# EAGLE design Board (EAGLE 7.2.0)
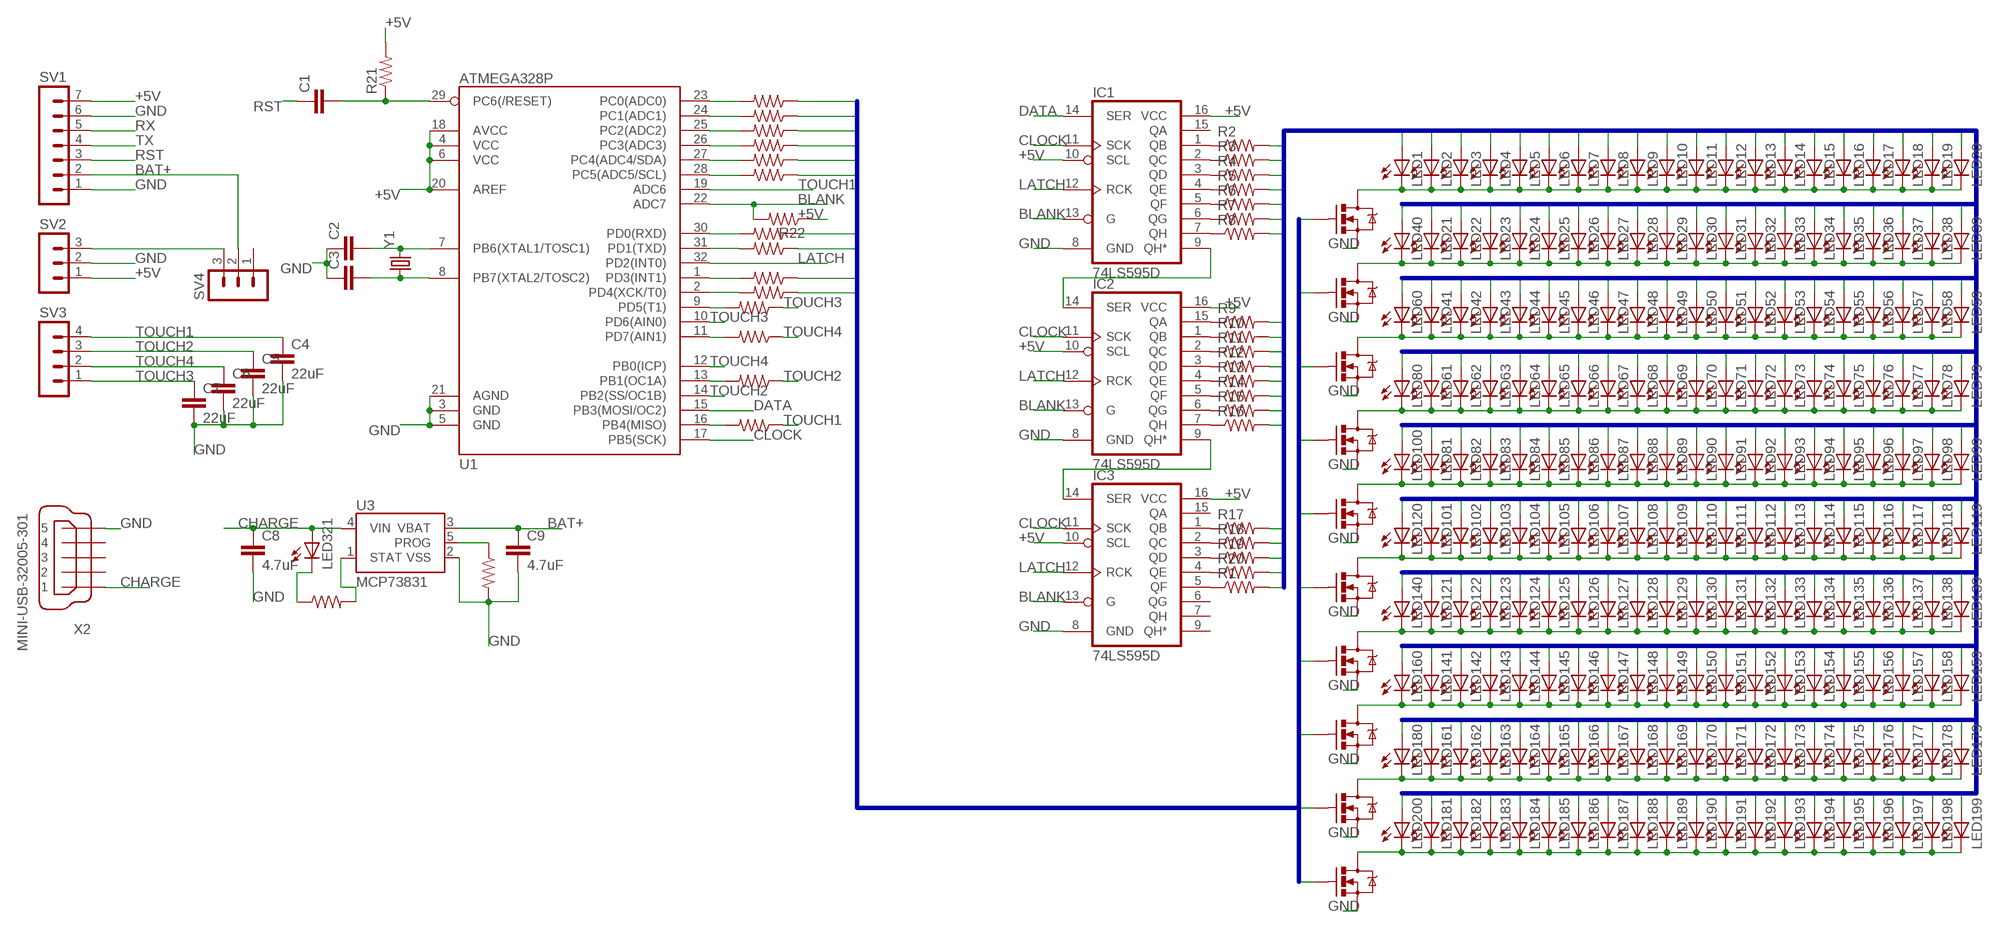
[diagram p0: schematic, sheet 1]

## Parts
2K  2K  100OHM1/10W1%(0603)  [0603-RES]
470R  470R  100OHM1/10W1%(0603)  [0603-RES]
C1  CAPPTH1  [CAP-PTH-5MM]
C2  22uF  22UF-6.3V-20%(0805)  [0805]
C3  22uF  22UF-6.3V-20%(0805)  [0805]
C4  22uF  22UF-6.3V-20%(0805)  [0805]
C5  22uF  22UF-6.3V-20%(0805)  [0805]
C6  22uF  22UF-6.3V-20%(0805)  [0805]
C7  22uF  22UF-6.3V-20%(0805)  [0805]
C8  4.7uF  0.1UF-25V(+80/-20%)(0603)  [0603-CAP]
C9  4.7uF  0.1UF-25V(+80/-20%)(0603)  [0603-CAP]
IC1  74LS595D  [SO16]
IC2  74LS595D  [SO16]
IC3  74LS595D  [SO16]
LED1  LED0603  [LED-0603]
LED2  LED0603  [LED-0603]
LED3  LED0603  [LED-0603]
LED4  LED0603  [LED-0603]
LED5  LED0603  [LED-0603]
LED6  LED0603  [LED-0603]
LED7  LED0603  [LED-0603]
LED8  LED0603  [LED-0603]
LED9  LED0603  [LED-0603]
LED10  LED0603  [LED-0603]
LED11  LED0603  [LED-0603]
LED12  LED0603  [LED-0603]
LED13  LED0603  [LED-0603]
LED14  LED0603  [LED-0603]
LED15  LED0603  [LED-0603]
LED16  LED0603  [LED-0603]
LED17  LED0603  [LED-0603]
LED18  LED0603  [LED-0603]
LED19  LED0603  [LED-0603]
LED20  LED0603  [LED-0603]
LED21  LED0603  [LED-0603]
LED22  LED0603  [LED-0603]
LED23  LED0603  [LED-0603]
LED24  LED0603  [LED-0603]
LED25  LED0603  [LED-0603]
LED26  LED0603  [LED-0603]
LED27  LED0603  [LED-0603]
LED28  LED0603  [LED-0603]
LED29  LED0603  [LED-0603]
LED30  LED0603  [LED-0603]
LED31  LED0603  [LED-0603]
LED32  LED0603  [LED-0603]
LED33  LED0603  [LED-0603]
LED34  LED0603  [LED-0603]
LED35  LED0603  [LED-0603]
LED36  LED0603  [LED-0603]
LED37  LED0603  [LED-0603]
LED38  LED0603  [LED-0603]
LED39  LED0603  [LED-0603]
LED40  LED0603  [LED-0603]
LED41  LED0603  [LED-0603]
LED42  LED0603  [LED-0603]
LED43  LED0603  [LED-0603]
LED44  LED0603  [LED-0603]
LED45  LED0603  [LED-0603]
LED46  LED0603  [LED-0603]
LED47  LED0603  [LED-0603]
LED48  LED0603  [LED-0603]
LED49  LED0603  [LED-0603]
LED50  LED0603  [LED-0603]
LED51  LED0603  [LED-0603]
LED52  LED0603  [LED-0603]
LED53  LED0603  [LED-0603]
LED54  LED0603  [LED-0603]
LED55  LED0603  [LED-0603]
LED56  LED0603  [LED-0603]
LED57  LED0603  [LED-0603]
LED58  LED0603  [LED-0603]
LED59  LED0603  [LED-0603]
LED60  LED0603  [LED-0603]
LED61  LED0603  [LED-0603]
LED62  LED0603  [LED-0603]
LED63  LED0603  [LED-0603]
LED64  LED0603  [LED-0603]
LED65  LED0603  [LED-0603]
LED66  LED0603  [LED-0603]
LED67  LED0603  [LED-0603]
LED68  LED0603  [LED-0603]
LED69  LED0603  [LED-0603]
LED70  LED0603  [LED-0603]
LED71  LED0603  [LED-0603]
LED72  LED0603  [LED-0603]
LED73  LED0603  [LED-0603]
LED74  LED0603  [LED-0603]
LED75  LED0603  [LED-0603]
LED76  LED0603  [LED-0603]
LED77  LED0603  [LED-0603]
LED78  LED0603  [LED-0603]
LED79  LED0603  [LED-0603]
LED80  LED0603  [LED-0603]
LED81  LED0603  [LED-0603]
LED82  LED0603  [LED-0603]
LED83  LED0603  [LED-0603]
LED84  LED0603  [LED-0603]
LED85  LED0603  [LED-0603]
LED86  LED0603  [LED-0603]
LED87  LED0603  [LED-0603]
LED88  LED0603  [LED-0603]
LED89  LED0603  [LED-0603]
LED90  LED0603  [LED-0603]
LED91  LED0603  [LED-0603]
LED92  LED0603  [LED-0603]
LED93  LED0603  [LED-0603]
LED94  LED0603  [LED-0603]
LED95  LED0603  [LED-0603]
LED96  LED0603  [LED-0603]
LED97  LED0603  [LED-0603]
LED98  LED0603  [LED-0603]
LED99  LED0603  [LED-0603]
LED100  LED0603  [LED-0603]
LED101  LED0603  [LED-0603]
LED102  LED0603  [LED-0603]
LED103  LED0603  [LED-0603]
LED104  LED0603  [LED-0603]
LED105  LED0603  [LED-0603]
LED106  LED0603  [LED-0603]
LED107  LED0603  [LED-0603]
LED108  LED0603  [LED-0603]
LED109  LED0603  [LED-0603]
LED110  LED0603  [LED-0603]
LED111  LED0603  [LED-0603]
LED112  LED0603  [LED-0603]
LED113  LED0603  [LED-0603]
LED114  LED0603  [LED-0603]
LED115  LED0603  [LED-0603]
LED116  LED0603  [LED-0603]
LED117  LED0603  [LED-0603]
LED118  LED0603  [LED-0603]
LED119  LED0603  [LED-0603]
LED120  LED0603  [LED-0603]
LED121  LED0603  [LED-0603]
LED122  LED0603  [LED-0603]
LED123  LED0603  [LED-0603]
LED124  LED0603  [LED-0603]
LED125  LED0603  [LED-0603]
LED126  LED0603  [LED-0603]
LED127  LED0603  [LED-0603]
LED128  LED0603  [LED-0603]
LED129  LED0603  [LED-0603]
LED130  LED0603  [LED-0603]
LED131  LED0603  [LED-0603]
LED132  LED0603  [LED-0603]
LED133  LED0603  [LED-0603]
LED134  LED0603  [LED-0603]
LED135  LED0603  [LED-0603]
LED136  LED0603  [LED-0603]
LED137  LED0603  [LED-0603]
LED138  LED0603  [LED-0603]
LED139  LED0603  [LED-0603]
LED140  LED0603  [LED-0603]
LED141  LED0603  [LED-0603]
LED142  LED0603  [LED-0603]
LED143  LED0603  [LED-0603]
LED144  LED0603  [LED-0603]
LED145  LED0603  [LED-0603]
LED146  LED0603  [LED-0603]
LED147  LED0603  [LED-0603]
LED148  LED0603  [LED-0603]
LED149  LED0603  [LED-0603]
LED150  LED0603  [LED-0603]
LED151  LED0603  [LED-0603]
LED152  LED0603  [LED-0603]
LED153  LED0603  [LED-0603]
LED154  LED0603  [LED-0603]
LED155  LED0603  [LED-0603]
LED156  LED0603  [LED-0603]
LED157  LED0603  [LED-0603]
LED158  LED0603  [LED-0603]
LED159  LED0603  [LED-0603]
LED160  LED0603  [LED-0603]
LED161  LED0603  [LED-0603]
LED162  LED0603  [LED-0603]
LED163  LED0603  [LED-0603]
LED164  LED0603  [LED-0603]
LED165  LED0603  [LED-0603]
LED166  LED0603  [LED-0603]
LED167  LED0603  [LED-0603]
LED168  LED0603  [LED-0603]
LED169  LED0603  [LED-0603]
LED170  LED0603  [LED-0603]
LED171  LED0603  [LED-0603]
LED172  LED0603  [LED-0603]
LED173  LED0603  [LED-0603]
LED174  LED0603  [LED-0603]
LED175  LED0603  [LED-0603]
LED176  LED0603  [LED-0603]
LED177  LED0603  [LED-0603]
LED178  LED0603  [LED-0603]
LED179  LED0603  [LED-0603]
LED180  LED0603  [LED-0603]
LED181  LED0603  [LED-0603]
LED182  LED0603  [LED-0603]
LED183  LED0603  [LED-0603]
LED184  LED0603  [LED-0603]
LED185  LED0603  [LED-0603]
LED186  LED0603  [LED-0603]
LED187  LED0603  [LED-0603]
LED188  LED0603  [LED-0603]
LED189  LED0603  [LED-0603]
LED190  LED0603  [LED-0603]
LED191  LED0603  [LED-0603]
LED192  LED0603  [LED-0603]
LED193  LED0603  [LED-0603]
LED194  LED0603  [LED-0603]
LED195  LED0603  [LED-0603]
LED196  LED0603  [LED-0603]
LED197  LED0603  [LED-0603]
LED198  LED0603  [LED-0603]
LED199  LED0603  [LED-0603]
LED200  LED0603  [LED-0603]
LED321  LED0603  [LED-0603]
Q1  MOSFET-NCHANNELBSS123LT1G  [SOT23]
Q2  MOSFET-NCHANNELBSS123LT1G  [SOT23]
Q3  MOSFET-NCHANNELBSS123LT1G  [SOT23]
Q6  MOSFET-NCHANNELBSS123LT1G  [SOT23]
Q8  MOSFET-NCHANNELBSS123LT1G  [SOT23]
Q10  MOSFET-NCHANNELBSS123LT1G  [SOT23]
Q12  MOSFET-NCHANNELBSS123LT1G  [SOT23]
Q14  MOSFET-NCHANNELBSS123LT1G  [SOT23]
Q16  MOSFET-NCHANNELBSS123LT1G  [SOT23]
Q19  MOSFET-NCHANNELBSS123LT1G  [SOT23]
R1  100  100OHM1/10W1%(0603)  [0603-RES]
R2  100  100OHM1/10W1%(0603)  [0603-RES]
R3  100  100OHM1/10W1%(0603)  [0603-RES]
R4  100  100OHM1/10W1%(0603)  [0603-RES]
R5  100  100OHM1/10W1%(0603)  [0603-RES]
R6  100  100OHM1/10W1%(0603)  [0603-RES]
R7  100  100OHM1/10W1%(0603)  [0603-RES]
R8  100  100OHM1/10W1%(0603)  [0603-RES]
R9  100  100OHM1/10W1%(0603)  [0603-RES]
R10  100  100OHM1/10W1%(0603)  [0603-RES]
R11  100  100OHM1/10W1%(0603)  [0603-RES]
R12  100  100OHM1/10W1%(0603)  [0603-RES]
R13  100  100OHM1/10W1%(0603)  [0603-RES]
R14  100  100OHM1/10W1%(0603)  [0603-RES]
R15  100  100OHM1/10W1%(0603)  [0603-RES]
R16  100  100OHM1/10W1%(0603)  [0603-RES]
R17  100  100OHM1/10W1%(0603)  [0603-RES]
R18  100  100OHM1/10W1%(0603)  [0603-RES]
R19  100  100OHM1/10W1%(0603)  [0603-RES]
R20  100  100OHM1/10W1%(0603)  [0603-RES]
R21  10K  100OHM1/10W1%(0603)  [0603-RES]
R22  10K  100OHM1/10W1%(0603)  [0603-RES]
R23  1M  100OHM1/10W1%(0603)  [0603-RES]
R24  1M  100OHM1/10W1%(0603)  [0603-RES]
R26  1M  100OHM1/10W1%(0603)  [0603-RES]
R30  100  100OHM1/10W1%(0603)  [0603-RES]
R31  100  100OHM1/10W1%(0603)  [0603-RES]
R32  100  100OHM1/10W1%(0603)  [0603-RES]
R33  100  100OHM1/10W1%(0603)  [0603-RES]
R34  100  100OHM1/10W1%(0603)  [0603-RES]
R35  100  100OHM1/10W1%(0603)  [0603-RES]
R36  100  100OHM1/10W1%(0603)  [0603-RES]
R37  100  100OHM1/10W1%(0603)  [0603-RES]
R38  100  100OHM1/10W1%(0603)  [0603-RES]
R39  100  100OHM1/10W1%(0603)  [0603-RES]
R40  1M  100OHM1/10W1%(0603)  [0603-RES]
SV1  MA07-1  [MA07-1]
SV2  MA03-1  [MA03-1]
SV3  MA04-1  [MA04-1]
SV4  MA03-1  [MA03-1]
U1  ATMEGA328P  ATMEGA328_SMT  [TQFP32-08]
U3  MCP73831  [SOT23-5]
X2  MINI-USB-32005-301  [32005-301]
Y1  CRYSTAL5X3  [CRYSTAL-SMD-5X3]

## Nets
+5V: IC1.10(SCL) IC1.16(VCC) IC2.10(SCL) IC2.16(VCC) IC3.10(SCL) IC3.16(VCC) R21.2 R22.1 SV1.7 SV2.1 U1.4(VCC) U1.6(VCC) U1.18(AVCC) U1.20(AREF)
A0: Q1.1(G) R37.1
A1: Q2.1(G) R36.1
A2: Q3.1(G) R39.1
A3: Q6.1(G) R38.1
A4: Q8.1(G) R35.1
A5: Q10.1(G) R34.1
A6: Q12.1(G) R33.1
A7: Q14.1(G) R32.1
A8: Q16.1(G) R31.1
A9: Q19.1(G) R30.1
BAT+: C9.1 SV1.2 SV4.2 U3.3(VBAT)
BLANK: IC1.13(G) IC2.13(G) IC3.13(G) R22.2 U1.22(ADC7)
CHARGE: C8.1 LED321.A U3.4(VIN) X2.1
CLOCK: IC1.11(SCK) IC2.11(SCK) IC3.11(SCK) U1.17(PB5(SCK))
D0: LED20.A LED40.A LED60.A LED80.A LED100.A LED120.A LED140.A LED160.A LED180.A LED200.A R1.2
D1: LED2.A LED21.A LED41.A LED61.A LED81.A LED101.A LED121.A LED141.A LED161.A LED181.A R2.2
D2: LED3.A LED22.A LED42.A LED62.A LED82.A LED102.A LED122.A LED142.A LED162.A LED182.A R3.2
D3: LED4.A LED23.A LED43.A LED63.A LED83.A LED103.A LED123.A LED143.A LED163.A LED183.A R4.2
D4: LED5.A LED24.A LED44.A LED64.A LED84.A LED104.A LED124.A LED144.A LED164.A LED184.A R5.2
D5: LED6.A LED25.A LED45.A LED65.A LED85.A LED105.A LED125.A LED145.A LED165.A LED185.A R6.2
D6: LED7.A LED26.A LED46.A LED66.A LED86.A LED106.A LED126.A LED146.A LED166.A LED186.A R7.2
D7: LED8.A LED27.A LED47.A LED67.A LED87.A LED107.A LED127.A LED147.A LED167.A LED187.A R8.2
D8: LED9.A LED28.A LED48.A LED68.A LED88.A LED108.A LED128.A LED148.A LED168.A LED188.A R9.2
D9: LED10.A LED29.A LED49.A LED69.A LED89.A LED109.A LED129.A LED149.A LED169.A LED189.A R10.2
D10: LED11.A LED30.A LED50.A LED70.A LED90.A LED110.A LED130.A LED150.A LED170.A LED190.A R11.2
D11: LED12.A LED31.A LED51.A LED71.A LED91.A LED111.A LED131.A LED151.A LED171.A LED191.A R12.2
D12: LED13.A LED32.A LED52.A LED72.A LED92.A LED112.A LED132.A LED152.A LED172.A LED192.A R13.2
D13: LED14.A LED33.A LED53.A LED73.A LED93.A LED113.A LED133.A LED153.A LED173.A LED193.A R14.2
D14: LED15.A LED34.A LED54.A LED74.A LED94.A LED114.A LED134.A LED154.A LED174.A LED194.A R15.2
D15: LED16.A LED35.A LED55.A LED75.A LED95.A LED115.A LED135.A LED155.A LED175.A LED195.A R16.2
D16: LED17.A LED36.A LED56.A LED76.A LED96.A LED116.A LED136.A LED156.A LED176.A LED196.A R17.2
D17: LED18.A LED37.A LED57.A LED77.A LED97.A LED117.A LED137.A LED157.A LED177.A LED197.A R18.2
D18: LED19.A LED38.A LED58.A LED78.A LED98.A LED118.A LED138.A LED158.A LED178.A LED198.A R19.2
D19: LED1.A LED39.A LED59.A LED79.A LED99.A LED119.A LED139.A LED159.A LED179.A LED199.A R20.2
DATA: IC1.14(SER) U1.15(PB3(MOSI/OC2))
GND: 2K.2 C2.1 C3.1 C4.2 C5.2 C6.2 C7.2 C8.2 C9.2 IC1.8(GND) IC2.8(GND) IC3.8(GND) Q1.2(S) Q2.2(S) Q3.2(S) Q6.2(S) Q8.2(S) Q10.2(S) Q12.2(S) Q14.2(S) Q16.2(S) Q19.2(S) SV1.1 SV1.6 SV2.2 U1.3(GND) U1.5(GND) U1.21(AGND) U3.2(VSS) X2.5
LATCH: IC1.12(RCK) IC2.12(RCK) IC3.12(RCK) U1.32(PD2(INT0))
N$1: LED1.C LED2.C LED3.C LED4.C LED5.C LED6.C LED7.C LED8.C LED9.C LED10.C LED11.C LED12.C LED13.C LED14.C LED15.C LED16.C LED17.C LED18.C LED19.C LED20.C Q1.3(D)
N$2: LED21.C LED22.C LED23.C LED24.C LED25.C LED26.C LED27.C LED28.C LED29.C LED30.C LED31.C LED32.C LED33.C LED34.C LED35.C LED36.C LED37.C LED38.C LED39.C LED40.C Q2.3(D)
N$3: LED181.C LED182.C LED183.C LED184.C LED185.C LED186.C LED187.C LED188.C LED189.C LED190.C LED191.C LED192.C LED193.C LED194.C LED195.C LED196.C LED197.C LED198.C LED199.C LED200.C Q19.3(D)
N$4: LED41.C LED42.C LED43.C LED44.C LED45.C LED46.C LED47.C LED48.C LED49.C LED50.C LED51.C LED52.C LED53.C LED54.C LED55.C LED56.C LED57.C LED58.C LED59.C LED60.C Q3.3(D)
N$5: LED61.C LED62.C LED63.C LED64.C LED65.C LED66.C LED67.C LED68.C LED69.C LED70.C LED71.C LED72.C LED73.C LED74.C LED75.C LED76.C LED77.C LED78.C LED79.C LED80.C Q6.3(D)
N$6: LED81.C LED82.C LED83.C LED84.C LED85.C LED86.C LED87.C LED88.C LED89.C LED90.C LED91.C LED92.C LED93.C LED94.C LED95.C LED96.C LED97.C LED98.C LED99.C LED100.C Q8.3(D)
N$7: LED101.C LED102.C LED103.C LED104.C LED105.C LED106.C LED107.C LED108.C LED109.C LED110.C LED111.C LED112.C LED113.C LED114.C LED115.C LED116.C LED117.C LED118.C LED119.C LED120.C Q10.3(D)
N$8: LED121.C LED122.C LED123.C LED124.C LED125.C LED126.C LED127.C LED128.C LED129.C LED130.C LED131.C LED132.C LED133.C LED134.C LED135.C LED136.C LED137.C LED138.C LED139.C LED140.C Q12.3(D)
N$9: LED141.C LED142.C LED143.C LED144.C LED145.C LED146.C LED147.C LED148.C LED149.C LED150.C LED151.C LED152.C LED153.C LED154.C LED155.C LED156.C LED157.C LED158.C LED159.C LED160.C Q14.3(D)
N$10: LED161.C LED162.C LED163.C LED164.C LED165.C LED166.C LED167.C LED168.C LED169.C LED170.C LED171.C LED172.C LED173.C LED174.C LED175.C LED176.C LED177.C LED178.C LED179.C LED180.C Q16.3(D)
N$11: R30.2 U1.23(PC0(ADC0))
N$12: R31.2 U1.24(PC1(ADC1))
N$13: R32.2 U1.25(PC2(ADC2))
N$14: R33.2 U1.26(PC3(ADC3))
N$15: R34.2 U1.27(PC4(ADC4/SDA))
N$16: R35.2 U1.28(PC5(ADC5/SCL))
N$17: IC1.2(QC) R3.1
N$18: IC1.3(QD) R4.1
N$19: IC1.4(QE) R5.1
N$20: IC1.5(QF) R6.1
N$21: IC1.6(QG) R7.1
N$22: IC1.7(QH) R8.1
N$23: IC2.15(QA) R9.1
N$24: IC2.1(QB) R10.1
N$25: IC2.2(QC) R11.1
N$26: IC2.3(QD) R12.1
N$27: IC2.4(QE) R13.1
N$28: IC2.5(QF) R14.1
N$29: IC2.6(QG) R15.1
N$30: IC2.7(QH) R16.1
N$31: IC3.1(QB) R17.1
N$32: IC3.2(QC) R18.1
N$33: IC3.3(QD) R19.1
N$34: IC3.4(QE) R20.1
N$35: IC3.5(QF) R1.1
N$36: IC1.1(QB) R2.1
N$37: C2.2 U1.7(PB6(XTAL1/TOSC1)) Y1.3
N$38: C1.2 R21.1 U1.29(PC6(/RESET))
N$39: C3.2 U1.8(PB7(XTAL2/TOSC2)) Y1.1
N$40: SV2.3 SV4.3
N$41: 470R.1 LED321.C
N$42: 470R.2 U3.1(STAT)
N$44: R23.2 U1.9(PD5(T1))
N$45: R24.2 U1.13(PB1(OC1A))
N$46: 2K.1 U3.5(PROG)
N$47: IC1.9(QH*) IC2.14(SER)
N$48: IC2.9(QH*) IC3.14(SER)
N$49: R26.2 U1.16(PB4(MISO))
N$52: R40.2 U1.11(PD7(AIN1))
N$54: R36.2 U1.1(PD3(INT1))
N$55: R37.2 U1.2(PD4(XCK/T0))
RST: C1.1 SV1.3
RX: R38.2 SV1.5 U1.30(PD0(RXD))
TOUCH1: C4.1 R26.1 SV3.4 U1.19(ADC6)
TOUCH2: C5.1 R24.1 SV3.3 U1.14(PB2(SS/OC1B))
TOUCH3: C7.1 R23.1 SV3.1 U1.10(PD6(AIN0))
TOUCH4: C6.1 R40.1 SV3.2 U1.12(PB0(ICP))
TX: R39.2 SV1.4 U1.31(PD1(TXD))
Unconnected: IC1.15(QA) IC3.6(QG) IC3.7(QH) IC3.9(QH*) IC3.15(QA) SV4.1 X2.2 X2.3 X2.4

## Buses
D[0..19]
A[0..9]

## Library data of the parts
2K 470R R21-R24 R26 R40 = SparkFun-Resistors:100OHM1/10W1%(0603): RES-07863; PROD_ID: RES-07863; VALUE: 100
C1 = SparkFun-Capacitors:CAP: Capacitor Standard 0603 ceramic capacitor, and 0.1" leaded capacitor.
C2-C7 = SparkFun-Capacitors:22UF-6.3V-20%(0805): Ceramic CAP-08402; PROD_ID: CAP-08402
C8 C9 = SparkFun-Capacitors:0.1UF-25V(+80/-20%)(0603): CAP-00810 Ceramic Standard decoupling cap; PROD_ID: CAP-00810; VALUE: 0.1uF
IC1-IC3 = SparkFun-DigitalIC:74*595: 8-bit SHIFT REGISTER, output latch
LED1-LED200 LED321 = SparkFun-LED:LED: LEDs Standard schematic elements and footprints for 5mm, 3mm, 1206, and 0603 sized LEDs. 5mm - Spark Fun Electronics SKU : COM-00529 (and others)
Q1-Q3 Q6 Q8 Q10 Q12 Q14 Q16 Q19 = SparkFun-DiscreteSemi:MOSFET-NCHANNEL: Common NMOSFET Parts MFG P/N Store ID Prod ID FDD8780 TRANS-09984 SI7820DN TRANS-11055 FDS6630A IC-08089 2N7002PW TRANS-11151 FQP30N06L COM-10213 TRANS-10060 BSS123LT1G TRANS-08345 BSS138 TRANS-00830 BS170 2N7000; PROD_ID: TRANS-08345
R1-R20 R30-R39 = SparkFun-Resistors:100OHM1/10W1%(0603): RES-07863; PROD_ID: RES-07863
SV1 = con-lstb:MA07-1: PIN HEADER; OC_FARNELL: unknown; OC_NEWARK: unknown
SV2 SV4 = con-lstb:MA03-1: PIN HEADER; OC_FARNELL: unknown; OC_NEWARK: unknown
SV3 = con-lstb:MA04-1: PIN HEADER; OC_FARNELL: unknown; OC_NEWARK: unknown
U1 = SparkFun-DigitalIC:ATMEGA328_SMT: 32-Pin Atmega328 part Commonly used on Arduino compatible boards Available in QFP and QFN packages TQFP is IC-09069 QFN is non-stock; PROD_ID: IC-09069
U3 = SparkFun-PowerIC:MCP73831: Miniature single cell, fully integrated Li-Ion, Li-polymer charge management controller http://ww1.microchip.com/downloads/en/DeviceDoc/21984a.pdf IC-09995; PROD_ID: IC-09995
X2 = con-cypressindustries:MINI-USB-: MINI USB-B Conector Source: www.cypressindustries.com; OC_FARNELL: unknown; OC_NEWARK: unknown
Y1 = SparkFun-FreqCtrl:CRYSTAL: Various standard crystals. Proven footprints. Spark Fun Electronics SKU : COM-00534

## Board
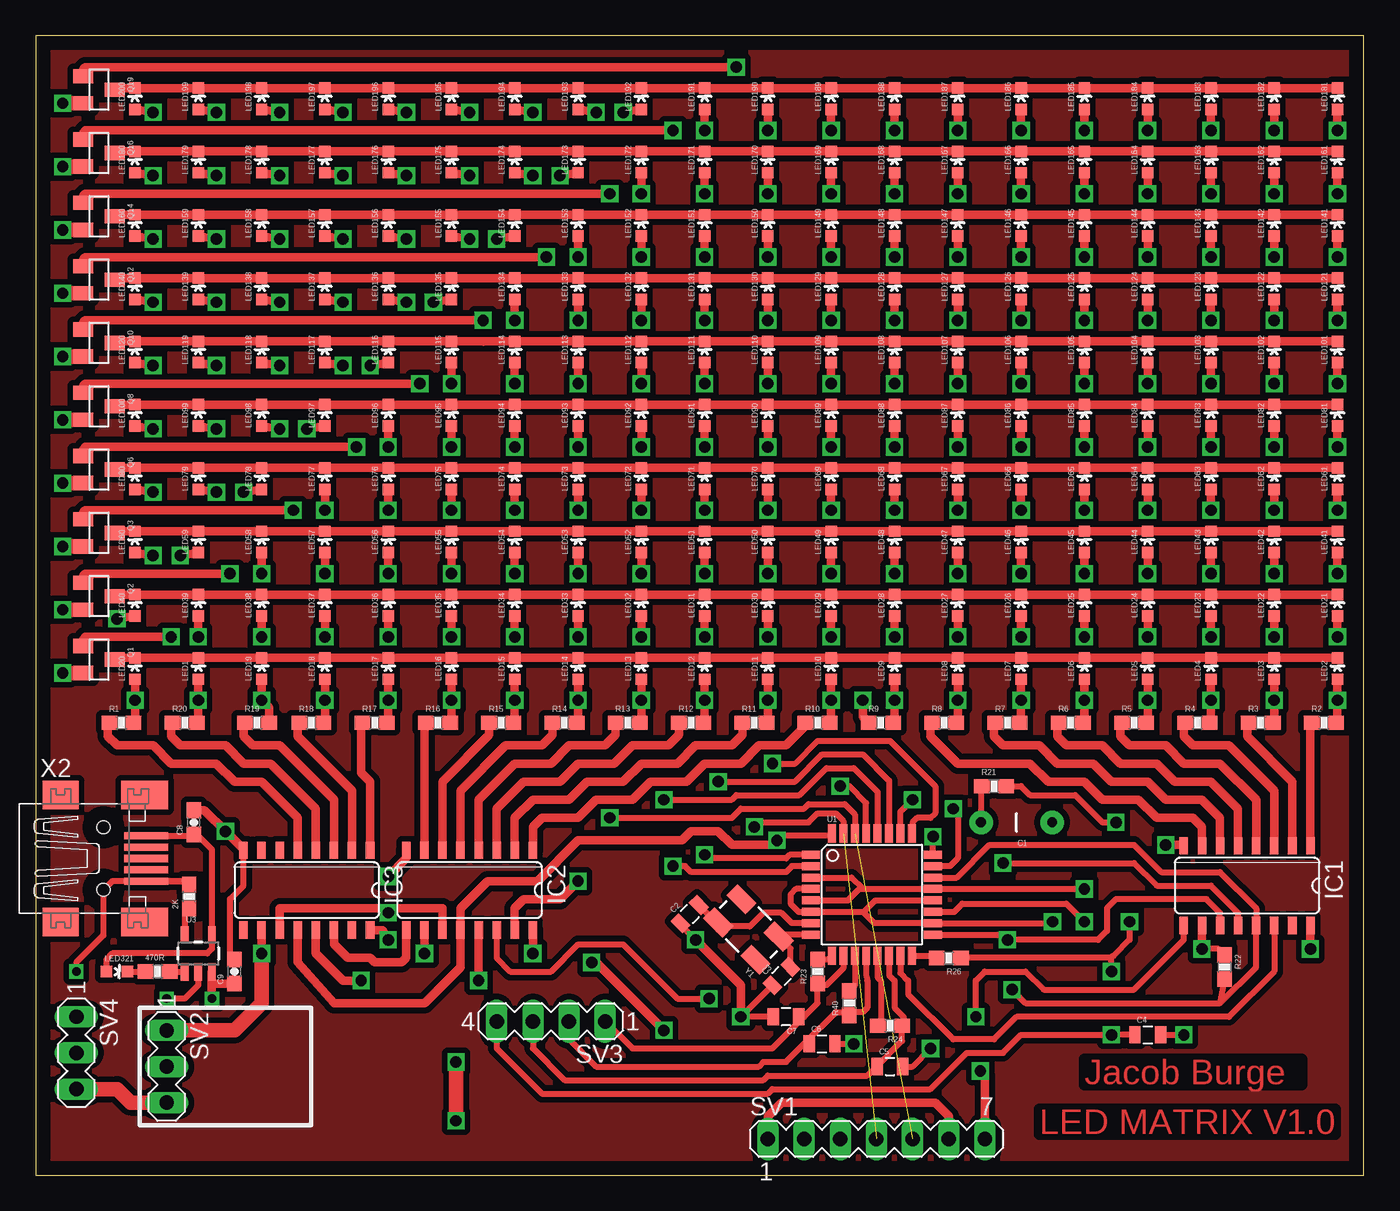
[diagram p1: board, top side]
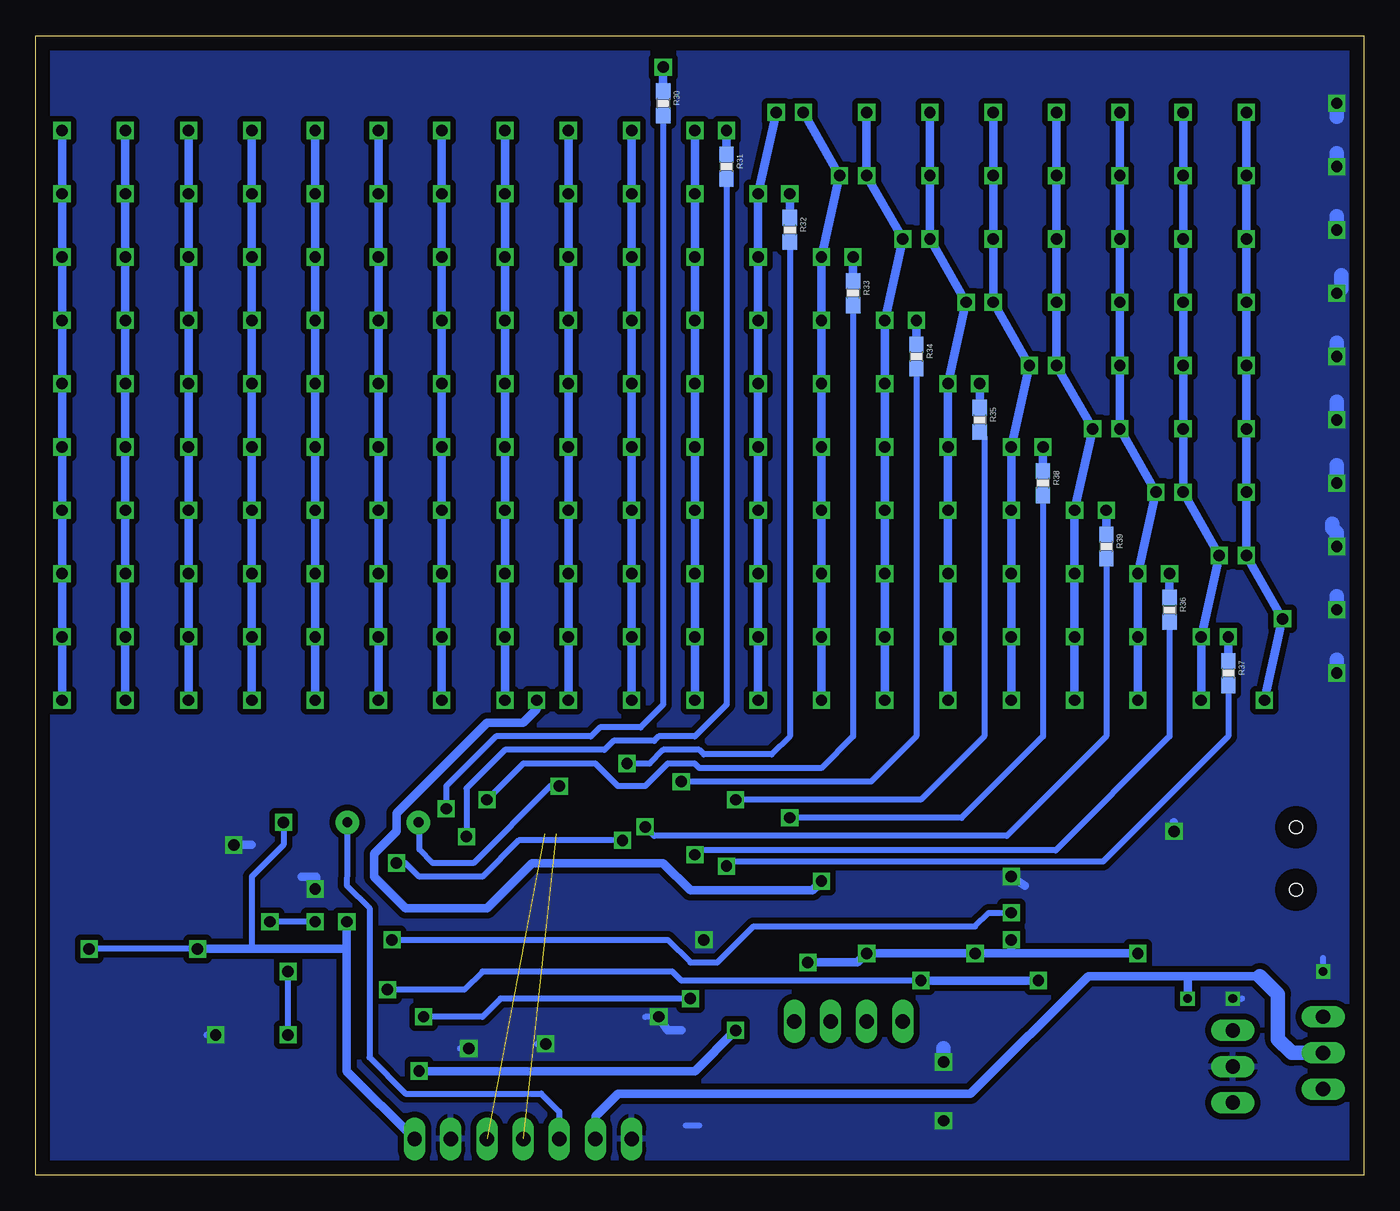
[diagram p2: board, bottom side, seen from below]

Size 93.3 x 80 mm. Coordinates in mm from the lower left corner, seen from the top.
Outline: 0,0 93.3,0 93.3,80 0,80 0,0
Copper layers (1*16): Top 0.035mm / dielectric 1.5mm / Bottom 0.035mm
Design rules "default": minimum track width 10mil, minimum drill 24mil, track to track 8mil, track to pad 8mil, pad to pad 8mil, via to via 8mil, smd to smd 8mil, copper to edge 40mil, drill to drill 8mil, minimum pad ring 10mil, minimum via ring 8mil, stop-mask expansion 4mil, vias tented up to drill 0mil, thermal gap 10mil

### Footprints (pad centres in the part's own frame; a part is rotated, then mirrored left to right if it is on the bottom)
0603-RES = smd 1.1 x 1: 1 -0.85,0; 2 0.85,0
CAP-PTH-5MM = drill 0.7 pad 1.651: 1 -2.5,0; 2 2.5,0
0805 = smd 0.8 x 1.2: 1 -0.9,0; 2 0.9,0
0603-CAP = smd 1.1 x 1: 1 -0.85,0; 2 0.85,0
SO16 = smd 0.6 x 1.2: 1 -4.445,-2.8; 2 -3.175,-2.8; 3 -1.905,-2.8; 4 -0.635,-2.8; 5 0.635,-2.8; 6 1.905,-2.8; 7 3.175,-2.8; 8 4.445,-2.8; 9 4.445,2.8; 10 3.175,2.8; 11 1.905,2.8; 12 0.635,2.8; 13 -0.635,2.8; 14 -1.905,2.8; 15 -3.175,2.8; 16 -4.445,2.8
LED-0603 = smd 0.8 x 0.8: A 0,-0.75; C 0,0.75
SOT23 = smd 1 x 1.4: 1 -0.95,-1.1; 2 0.95,-1.1; 3 0,1.1
MA07-1 = drill 1.016 long: 1 -7.62,0; 2 -5.08,0; 3 -2.54,0; 4 0,0; 5 2.54,0; 6 5.08,0; 7 7.62,0
MA03-1 = drill 1.016 long: 1 -2.54,0; 2 0,0; 3 2.54,0
MA04-1 = drill 1.016 long: 1 -3.81,0; 2 -1.27,0; 3 1.27,0; 4 3.81,0
TQFP32-08 = smd 1.27 x 0.559: 1 -4.293,2.8; 2 -4.293,2; 3 -4.293,1.2; 4 -4.293,0.4; 5 -4.293,-0.4; 6 -4.293,-1.2; 7 -4.293,-2; 8 -4.293,-2.8; 17 4.293,-2.8; 18 4.293,-2; 19 4.293,-1.2; 20 4.293,-0.4; 21 4.293,0.4; 22 4.293,1.2; 23 4.293,2; 24 4.293,2.8 | smd 0.559 x 1.27: 9 -2.8,-4.293; 10 -2,-4.293; 11 -1.2,-4.293; 12 -0.4,-4.293; 13 0.4,-4.293; 14 1.2,-4.293; 15 2,-4.293; 16 2.8,-4.293; 25 2.8,4.293; 26 2,4.293; 27 1.2,4.293; 28 0.4,4.293; 29 -0.4,4.293; 30 -1.2,4.293; 31 -2,4.293; 32 -2.8,4.293
SOT23-5 = smd 0.55 x 1.2: 1 -0.95,-1.3; 2 0,-1.3; 3 0.95,-1.3; 4 0.95,1.3; 5 -0.95,1.3
32005-301 = smd 3.1 x 0.5: 1 3,1.6; 2 3,0.8; 3 3,0; 4 3,-0.8; 5 3,-1.6 | smd 2.5 x 2: M1 -3,-4.45; M2 -3,4.45 | smd 3.3 x 2: M3 2.9,4.45; M4 2.9,-4.45 | hole 0.9: 0,2.2; 0,-2.2
CRYSTAL-SMD-5X3 = smd 1.9 x 1.1: 1 -1.85,-1.15; 2 1.85,-1.15; 3 1.85,1.15; 4 -1.85,1.15

### Placement (x,y rotation side)
2K  10.79,19.55 90 top
470R  8.57,14.29 0 top
C1  68.9,24.77 180 top
C2  45.94,18.32 45 top
C3  52.39,13.97 45 top
C4  78.11,9.84 0 top
C5  60.01,7.62 0 top
C6  55.24,9.21 0 top
C7  52.7,11.11 180 top
C8  11.11,24.77 90 top
C9  13.97,14.29 90 top
IC1  85.09,20.32 180 top
IC2  30.48,20 180 top
IC3  19.05,20 180 top
LED1  11.43,35.56 0 top
LED2  91.44,35.56 0 top
LED3  87,35.56 0 top
LED4  82.55,35.56 0 top
LED5  78.11,35.56 0 top
LED6  73.66,35.56 0 top
LED7  69.22,35.56 0 top
LED8  64.77,35.56 0 top
LED9  60.33,35.56 0 top
LED10  55.88,35.56 0 top
LED11  51.44,35.56 0 top
LED12  46.99,35.56 0 top
LED13  42.55,35.56 0 top
LED14  38.1,35.56 0 top
LED15  33.66,35.56 0 top
LED16  29.21,35.56 0 top
LED17  24.77,35.56 0 top
LED18  20.32,35.56 0 top
LED19  15.88,35.56 0 top
LED20  6.99,35.56 0 top
LED21  91.44,40.01 0 top
LED22  87,40.01 0 top
LED23  82.55,40.01 0 top
LED24  78.11,40.01 0 top
LED25  73.66,40.01 0 top
LED26  69.22,40.01 0 top
LED27  64.77,40.01 0 top
LED28  60.33,40.01 0 top
LED29  55.88,40.01 0 top
LED30  51.44,40.01 0 top
LED31  46.99,40.01 0 top
LED32  42.55,40.01 0 top
LED33  38.1,40.01 0 top
LED34  33.66,40.01 0 top
LED35  29.21,40.01 0 top
LED36  24.77,40.01 0 top
LED37  20.32,40.01 0 top
LED38  15.88,40.01 0 top
LED39  11.43,40.01 0 top
LED40  6.99,40.01 0 top
LED41  91.44,44.45 0 top
LED42  87,44.45 0 top
LED43  82.55,44.45 0 top
LED44  78.11,44.45 0 top
LED45  73.66,44.45 0 top
LED46  69.22,44.45 0 top
LED47  64.77,44.45 0 top
LED48  60.33,44.45 0 top
LED49  55.88,44.45 0 top
LED50  51.44,44.45 0 top
LED51  46.99,44.45 0 top
LED52  42.55,44.45 0 top
LED53  38.1,44.45 0 top
LED54  33.66,44.45 0 top
LED55  29.21,44.45 0 top
LED56  24.77,44.45 0 top
LED57  20.32,44.45 0 top
LED58  15.88,44.45 0 top
LED59  11.43,44.45 0 top
LED60  6.99,44.45 0 top
LED61  91.44,48.9 0 top
LED62  87,48.9 0 top
LED63  82.55,48.9 0 top
LED64  78.11,48.9 0 top
LED65  73.66,48.9 0 top
LED66  69.22,48.9 0 top
LED67  64.77,48.9 0 top
LED68  60.33,48.9 0 top
LED69  55.88,48.9 0 top
LED70  51.44,48.9 0 top
LED71  46.99,48.9 0 top
LED72  42.55,48.9 0 top
LED73  38.1,48.9 0 top
LED74  33.66,48.9 0 top
LED75  29.21,48.9 0 top
LED76  24.77,48.9 0 top
LED77  20.32,48.9 0 top
LED78  15.88,48.9 0 top
LED79  11.43,48.9 0 top
LED80  6.99,48.9 0 top
LED81  91.44,53.34 0 top
LED82  87,53.34 0 top
LED83  82.55,53.34 0 top
LED84  78.11,53.34 0 top
LED85  73.66,53.34 0 top
LED86  69.22,53.34 0 top
LED87  64.77,53.34 0 top
LED88  60.33,53.34 0 top
LED89  55.88,53.34 0 top
LED90  51.44,53.34 0 top
LED91  46.99,53.34 0 top
LED92  42.55,53.34 0 top
LED93  38.1,53.34 0 top
LED94  33.66,53.34 0 top
LED95  29.21,53.34 0 top
LED96  24.77,53.34 0 top
LED97  20.32,53.34 0 top
LED98  15.88,53.34 0 top
LED99  11.43,53.34 0 top
LED100  6.99,53.34 0 top
LED101  91.44,57.78 0 top
LED102  87,57.78 0 top
LED103  82.55,57.78 0 top
LED104  78.11,57.78 0 top
LED105  73.66,57.78 0 top
LED106  69.22,57.78 0 top
LED107  64.77,57.78 0 top
LED108  60.33,57.78 0 top
LED109  55.88,57.78 0 top
LED110  51.44,57.78 0 top
LED111  46.99,57.78 0 top
LED112  42.55,57.78 0 top
LED113  38.1,57.78 0 top
LED114  33.66,57.78 0 top
LED115  29.21,57.78 0 top
LED116  24.77,57.78 0 top
LED117  20.32,57.78 0 top
LED118  15.88,57.78 0 top
LED119  11.43,57.78 0 top
LED120  6.99,57.78 0 top
LED121  91.44,62.23 0 top
LED122  87,62.23 0 top
LED123  82.55,62.23 0 top
LED124  78.11,62.23 0 top
LED125  73.66,62.23 0 top
LED126  69.22,62.23 0 top
LED127  64.77,62.23 0 top
LED128  60.33,62.23 0 top
LED129  55.88,62.23 0 top
LED130  51.44,62.23 0 top
LED131  46.99,62.23 0 top
LED132  42.55,62.23 0 top
LED133  38.1,62.23 0 top
LED134  33.66,62.23 0 top
LED135  29.21,62.23 0 top
LED136  24.77,62.23 0 top
LED137  20.32,62.23 0 top
LED138  15.88,62.23 0 top
LED139  11.43,62.23 0 top
LED140  6.99,62.23 0 top
LED141  91.44,66.67 0 top
LED142  87,66.67 0 top
LED143  82.55,66.67 0 top
LED144  78.11,66.67 0 top
LED145  73.66,66.67 0 top
LED146  69.22,66.67 0 top
LED147  64.77,66.67 0 top
LED148  60.33,66.67 0 top
LED149  55.88,66.67 0 top
LED150  51.44,66.67 0 top
LED151  46.99,66.67 0 top
LED152  42.55,66.67 0 top
LED153  38.1,66.67 0 top
LED154  33.66,66.67 0 top
LED155  29.21,66.67 0 top
LED156  24.77,66.67 0 top
LED157  20.32,66.67 0 top
LED158  15.88,66.67 0 top
LED159  11.43,66.67 0 top
LED160  6.99,66.67 0 top
LED161  91.44,71.12 0 top
LED162  87,71.12 0 top
LED163  82.55,71.12 0 top
LED164  78.11,71.12 0 top
LED165  73.66,71.12 0 top
LED166  69.22,71.12 0 top
LED167  64.77,71.12 0 top
LED168  60.33,71.12 0 top
LED169  55.88,71.12 0 top
LED170  51.44,71.12 0 top
LED171  46.99,71.12 0 top
LED172  42.55,71.12 0 top
LED173  38.1,71.12 0 top
LED174  33.66,71.12 0 top
LED175  29.21,71.12 0 top
LED176  24.77,71.12 0 top
LED177  20.32,71.12 0 top
LED178  15.88,71.12 0 top
LED179  11.43,71.12 0 top
LED180  6.99,71.12 0 top
LED181  91.44,75.56 0 top
LED182  87,75.56 0 top
LED183  82.55,75.56 0 top
LED184  78.11,75.56 0 top
LED185  73.66,75.56 0 top
LED186  69.22,75.56 0 top
LED187  64.77,75.56 0 top
LED188  60.33,75.56 0 top
LED189  55.88,75.56 0 top
LED190  51.44,75.56 0 top
LED191  46.99,75.56 0 top
LED192  42.55,75.56 0 top
LED193  38.1,75.56 0 top
LED194  33.66,75.56 0 top
LED195  29.21,75.56 0 top
LED196  24.77,75.56 0 top
LED197  20.32,75.56 0 top
LED198  15.88,75.56 0 top
LED199  11.43,75.56 0 top
LED200  6.99,75.56 0 top
LED321  5.71,14.29 270 top
Q1  4.45,36.2 270 top
Q2  4.45,40.64 270 top
Q3  4.45,45.09 270 top
Q6  4.45,49.53 270 top
Q8  4.45,53.98 270 top
Q10  4.45,58.42 270 top
Q12  4.45,62.87 270 top
Q14  4.45,67.31 270 top
Q16  4.45,71.75 270 top
Q19  4.45,76.2 270 top
R1  6.03,31.75 0 top
R2  90.49,31.75 0 top
R3  86.04,31.75 0 top
R4  81.6,31.75 0 top
R5  77.15,31.75 0 top
R6  72.71,31.75 0 top
R7  68.26,31.75 0 top
R8  63.82,31.75 0 top
R9  59.37,31.75 0 top
R10  54.93,31.75 0 top
R11  50.48,31.75 0 top
R12  46.04,31.75 0 top
R13  41.59,31.75 0 top
R14  37.15,31.75 0 top
R15  32.7,31.75 0 top
R16  28.26,31.75 0 top
R17  23.81,31.75 0 top
R18  19.37,31.75 0 top
R19  15.56,31.75 0 top
R20  10.48,31.75 0 top
R21  67.31,27.3 0 top
R22  83.5,14.61 270 top
R23  54.93,14.29 90 top
R24  60.01,10.48 180 top
R26  64.14,15.24 180 top
R30  49.21,75.25 270 bottom
R31  44.77,70.8 270 bottom
R32  40.32,66.36 270 bottom
R33  35.88,61.91 270 bottom
R34  31.43,57.47 270 bottom
R35  26.99,53.02 270 bottom
R36  13.65,39.69 270 bottom
R37  9.53,35.24 270 bottom
R38  22.54,48.58 270 bottom
R39  18.1,44.13 270 bottom
R40  57.15,12.06 90 top
SV1  59.05,2.54 0 top
SV2  9.21,7.62 270 top
SV3  36.2,10.79 180 top
SV4  2.86,8.57 270 top
U1  58.74,19.68 0 top
U3  11.43,15.56 0 top
X2  4.76,22.23 0 top
Y1  50.07,17.24 135 top

### Tracks (layer width: path | path; a pad name or v marks a point on that pad's centre or on a via)
+5V  (via drill 0.8)
  Top 0.406: 58.1,18.48 U1.6 53.59,18.48 53.02,19.05 53.02,19.68 53.42,20.09 U1.4 | 58.1,18.48 58.17,18.48 58.97,19.29 U1.20 | 58.1,18.48 58.9,17.68 U1.18 70.9,17.68 v71.44,17.78 | R21.2 69.22,27.3 69.85,26.67 73.03,26.67 74.93,24.77 v75.88,24.77 | R22.1 83.08,15.88 v81.92,15.88
  Top 0.61: IC1.10 v81.92,15.88 | IC1.16 v89.53,15.88 | IC3.10 v15.88,15.56 | IC2.10 v27.3,15.56 | v34.92,15.56 IC2.16 | IC3.16 24.39,17.2 v24.77,16.51 | v39.05,14.92 39.37,14.92 v44.13,10.16 | v66.36,7.3 66.67,6.99 SV1.7
  Top 1.016: SV2.1 13.97,10.16 15.88,12.06 v15.88,15.56
  Bottom 0.406: v81.92,15.88 v89.53,15.88 | v75.88,24.77 75.88,23.18 78.11,20.95 78.11,15.88
  Bottom 0.61: 71.44,15.88 71.44,7.3 SV1.7 | v81.92,15.88 78.11,15.88 71.44,15.88 | 71.44,15.88 v71.44,17.78 | v15.88,15.56 24.77,15.56 | 24.77,15.56 v27.3,15.56 v34.92,15.56 35.56,14.92 v39.05,14.92 | v24.77,16.51 24.77,15.56 | v44.13,10.16 46.99,7.3 v66.36,7.3
A0  (via drill 0.8)
  Top 0.61: Q1.1 3.35,37.63 3.49,37.78 v9.53,37.78
  Bottom 0.61: R37.1 v9.53,37.78
A1  (via drill 0.8)
  Top 0.61: Q2.1 3.35,42.08 3.49,42.23 v13.65,42.23
  Bottom 0.61: R36.1 v13.65,42.23
A2  (via drill 0.8)
  Top 0.61: Q3.1 3.35,46.52 3.49,46.67 v18.1,46.67
  Bottom 0.61: R39.1 v18.1,46.67
A3  (via drill 0.8)
  Top 0.61: Q6.1 3.35,50.97 3.49,51.12 v22.54,51.12
  Bottom 0.61: R38.1 v22.54,51.12
A4  (via drill 0.8)
  Top 0.61: 3.49,54.93 3.49,54.92 Q8.1 3.35,55.41 3.49,55.56 v26.99,55.56
  Bottom 0.61: R35.1 v26.99,55.56
A5  (via drill 0.8)
  Top 0.61: Q10.1 3.35,59.86 3.49,60.01 v31.43,60.01
  Bottom 0.61: R34.1 v31.43,60.01
A6  (via drill 0.8)
  Top 0.61: Q12.1 3.35,64.31 3.49,64.45 v35.88,64.45
  Bottom 0.61: R33.1 v35.88,64.45
A7  (via drill 0.8)
  Top 0.61: Q14.1 3.35,68.75 3.49,68.9 v40.32,68.9
  Bottom 0.61: R32.1 v40.32,68.9
A8  (via drill 0.8)
  Top 0.61: Q16.1 3.35,73.19 3.49,73.34 v44.77,73.34
  Bottom 0.61: R31.1 v44.77,73.34
A9  (via drill 0.8)
  Top 0.61: Q19.1 3.35,77.64 3.49,77.79 v49.21,77.79
  Bottom 0.61: R30.1 v49.21,77.79
BAT+  (via drill 0.6)
  Top 0.406: 12.38,13.44 U3.3
  Top 0.61: C9.1 12.38,13.44 | U3.3 v12.38,12.38
  Bottom 0.61: 7.3,13.97 12.38,13.97 | 12.38,13.97 19.37,13.97 27.62,5.71 52.39,5.71 53.98,4.13 SV1.2 | v12.38,12.38 12.38,13.97
  Bottom 1.016: SV4.2 5.08,8.57 6.03,9.53 6.03,12.7 7.3,13.97
BLANK  (via drill 0.8)
  Top 0.406: U1.22 64.7,20.89 66.99,23.18 77.15,23.18 79.06,21.27 83.19,21.27 85.72,18.73 IC1.13 85.72,14.61 83.19,12.06 | v68.58,13.02 69.53,12.06 83.19,12.06 | R22.2 83.19,12.06
  Top 0.61: IC3.13 19.68,15.56 21.59,13.65 v22.86,13.65 | v31.11,13.65 IC2.13
  Bottom 0.406: v31.11,13.65 47.94,13.65 48.58,14.29 61.91,14.29 63.18,13.02 v68.58,13.02
  Bottom 0.61: v22.86,13.65 v31.11,13.65
CHARGE
  Top 0.406: X2.1 10.79,23.82 C8.1 11.53,23.71 12.38,22.86 U3.4 12.38,16.83 12.38,15.88 12.06,15.56 5.4,15.56 4.96,15.12 LED321.A
CLOCK  (via drill 0.8)
  Top 0.406: IC1.11 83.19,18.41 82.23,19.37 75.88,19.37 75.25,18.73 75.25,17.14 74.61,16.51 v68.26,16.51 67.89,16.89 U1.17
  Top 0.61: IC3.11 17.14,18.73 24.45,18.73 v24.77,18.41 25.08,18.73 28.57,18.73 IC2.11
  Bottom 0.406: v24.77,18.41 26.35,18.41 27.3,17.46 42.86,17.46 45.4,14.92 47.31,14.92 48.9,16.51 v68.26,16.51
D0  (via drill 0.8)
  Top 0.406: 6.99,31.85 6.88,31.85 R1.2
  Top 0.61: LED180.A v8.26,70.17 | LED20.A v6.99,33.34 6.99,31.85 | LED160.A v8.26,65.72 | LED140.A v8.26,61.28 | LED120.A v8.26,56.83 | LED100.A v8.26,52.39 | LED80.A v8.26,47.94 | LED60.A v8.26,43.5 | LED40.A v5.71,39.05 | LED200.A v8.26,74.61
  Bottom 0.61: v8.26,74.61 v8.26,70.17 v8.26,65.72 v8.26,61.28 v8.26,56.83 v8.26,52.39 v8.26,47.94 v8.26,43.5 v5.71,39.05 v6.99,33.34
D1  (via drill 0.8)
  Top 0.61: LED181.A v91.44,73.34 | LED2.A v91.44,33.34 91.44,31.85 R2.2 | LED21.A v91.44,37.78 | LED161.A v91.44,68.9 | LED141.A v91.44,64.45 | LED121.A v91.44,60.01 | LED101.A v91.44,55.56 | LED81.A v91.44,51.12 | LED61.A v91.44,46.67 | LED41.A v91.44,42.23
  Bottom 0.61: v91.44,73.34 v91.44,68.9 v91.44,64.45 v91.44,60.01 v91.44,55.56 v91.44,51.12 v91.44,46.67 v91.44,42.23 v91.44,37.78 v91.44,33.34
D2  (via drill 0.8)
  Top 0.61: LED182.A v87,73.34 | LED3.A v87,33.34 87,31.85 R3.2 | LED22.A v87,37.78 | LED162.A v87,68.9 | LED122.A v87,60.01 | LED142.A v87,64.45 | LED102.A v87,55.56 | LED82.A v87,51.12 | LED62.A v87,46.67 | LED42.A v87,42.23
  Bottom 0.61: v87,73.34 v87,68.9 v87,64.45 v87,60.01 v87,55.56 v87,51.12 v87,46.67 v87,42.23 v87,37.78 v87,33.34
D3  (via drill 0.8)
  Top 0.61: LED183.A v82.55,73.34 | LED4.A v82.55,33.34 82.55,31.85 R4.2 | LED23.A v82.55,37.78 | LED163.A v82.55,68.9 | LED143.A v82.55,64.45 | LED123.A v82.55,60.01 | LED103.A v82.55,55.56 | LED83.A v82.55,51.12 | LED63.A v82.55,46.67 | LED43.A v82.55,42.23
  Bottom 0.61: v82.55,73.34 v82.55,68.9 v82.55,64.45 v82.55,60.01 v82.55,55.56 v82.55,51.12 v82.55,46.67 v82.55,42.23 v82.55,37.78 v82.55,33.34
D4  (via drill 0.8)
  Top 0.61: LED184.A v78.11,73.34 | LED5.A v78.11,33.34 78.11,31.85 R5.2 | LED24.A v78.11,37.78 | LED164.A v78.11,68.9 | LED144.A v78.11,64.45 | LED124.A v78.11,60.01 | LED104.A v78.11,55.56 | LED84.A v78.11,51.12 | LED64.A v78.11,46.67 | LED44.A v78.11,42.23
  Bottom 0.61: v78.11,73.34 v78.11,68.9 v78.11,64.45 v78.11,60.01 v78.11,55.56 v78.11,51.12 v78.11,46.67 v78.11,42.23 v78.11,37.78 v78.11,33.34
D5  (via drill 0.8)
  Top 0.61: LED185.A v73.66,73.34 | LED6.A v73.66,33.34 73.66,31.85 R6.2 | LED25.A v73.66,37.78 | LED165.A v73.66,68.9 | LED145.A v73.66,64.45 | LED125.A v73.66,60.01 | LED105.A v73.66,55.56 | LED85.A v73.66,51.12 | LED65.A v73.66,46.67 | LED45.A v73.66,42.23
  Bottom 0.61: v73.66,73.34 v73.66,68.9 v73.66,64.45 v73.66,60.01 v73.66,55.56 v73.66,51.12 v73.66,46.67 v73.66,42.23 v73.66,37.78 v73.66,33.34
D6  (via drill 0.8)
  Top 0.61: LED186.A v69.22,73.34 | LED7.A v69.22,33.34 69.22,31.96 R7.2 | LED26.A v69.22,37.78 | LED166.A v69.22,68.9 | LED146.A v69.22,64.45 | LED126.A v69.22,60.01 | LED106.A v69.22,55.56 | LED86.A v69.22,51.12 | LED66.A v69.22,46.67 | LED46.A v69.22,42.23
  Bottom 0.61: v69.22,73.34 v69.22,68.9 v69.22,64.45 v69.22,60.01 v69.22,55.56 v69.22,51.12 v69.22,46.67 v69.22,42.23 v69.22,37.78 v69.22,33.34
D7  (via drill 0.8)
  Top 0.61: LED187.A v64.77,73.34 | LED8.A v64.77,33.34 64.77,31.85 R8.2 | LED27.A v64.77,37.78 | LED167.A v64.77,68.9 | LED147.A v64.77,64.45 | LED127.A v64.77,60.01 | LED107.A v64.77,55.56 | LED87.A v64.77,51.12 | LED67.A v64.77,46.67 | LED47.A v64.77,42.23
  Bottom 0.61: v64.77,73.34 v64.77,68.9 v64.77,64.45 v64.77,60.01 v64.77,55.56 v64.77,51.12 v64.77,46.67 v64.77,42.23 v64.77,37.78 v64.77,33.34
D8  (via drill 0.8)
  Top 0.61: LED188.A v60.33,73.34 | LED9.A v60.33,33.34 60.33,31.85 R9.2 | LED28.A v60.33,37.78 | LED168.A v60.33,68.9 | LED148.A v60.33,64.45 | LED128.A v60.33,60.01 | LED108.A v60.33,55.56 | LED88.A v60.33,51.12 | LED68.A v60.33,46.67 | LED48.A v60.33,42.23
  Bottom 0.61: v60.33,73.34 v60.33,68.9 v60.33,64.45 v60.33,60.01 v60.33,55.56 v60.33,51.12 v60.33,46.67 v60.33,42.23 v60.33,37.78 v60.33,33.34
D9  (via drill 0.8)
  Top 0.61: LED189.A v55.88,73.34 | LED10.A v55.88,33.34 55.88,31.85 arc-90 R10.2 | LED29.A v55.88,37.78 | LED169.A v55.88,68.9 | LED149.A v55.88,64.45 | LED129.A v55.88,60.01 | LED109.A v55.88,55.56 | LED89.A v55.88,51.12 | LED69.A v55.88,46.67 | LED49.A v55.88,42.23
  Bottom 0.61: v55.88,73.34 v55.88,68.9 v55.88,64.45 v55.88,60.01 v55.88,55.56 v55.88,51.12 v55.88,46.67 v55.88,42.23 v55.88,37.78 v55.88,33.34
D10  (via drill 0.8)
  Top 0.61: LED11.A v51.44,33.34 51.44,31.85 arc90 R11.2 | LED30.A v51.44,37.78 | LED170.A v51.44,68.9 | LED150.A v51.44,64.45 | LED130.A v51.44,60.01 | LED110.A v51.44,55.56 | LED90.A v51.44,51.12 | LED70.A v51.44,46.67 | LED50.A v51.44,42.23 | LED190.A v51.44,73.34
  Bottom 0.61: v51.44,73.34 v51.44,68.9 v51.44,64.45 v51.44,60.01 v51.44,55.56 v51.44,51.12 v51.44,46.67 v51.44,42.23 v51.44,37.78 v51.44,33.34
D11  (via drill 0.8)
  Top 0.61: LED191.A v46.99,73.34 | LED12.A v46.99,33.34 46.99,31.85 arc90 R12.2 | LED31.A v46.99,37.78 | LED151.A v46.99,64.45 | LED131.A v46.99,60.01 | LED111.A v46.99,55.56 | LED91.A v46.99,51.12 | LED71.A v46.99,46.67 | LED51.A v46.99,42.23 | LED171.A v46.99,68.9
  Bottom 0.61: v46.99,73.34 v46.99,68.9 v46.99,64.45 v46.99,60.01 v46.99,55.56 v46.99,51.12 v46.99,46.67 v46.99,42.23 v46.99,37.78 v46.99,33.34
D12  (via drill 0.8)
  Top 0.61: LED192.A v41.27,74.61 | LED13.A v42.55,33.34 42.55,31.85 arc90 R13.2 | LED32.A v42.55,37.78 | LED172.A v42.55,68.9 | LED132.A v42.55,60.01 | LED52.A v42.55,42.23 | LED72.A v42.55,46.67 | LED112.A v42.55,55.56 | LED92.A v42.55,51.12 | LED152.A v42.55,64.45
  Bottom 0.61: v41.27,74.61 v42.55,68.9 v42.55,64.45 v42.55,60.01 v42.55,55.56 v42.55,51.12 v42.55,46.67 v42.55,42.23 v42.55,37.78 v42.55,33.34
D13  (via drill 0.8)
  Top 0.61: LED193.A v39.37,74.61 | LED14.A v38.1,33.34 38.1,31.85 arc-90 R14.2 | LED33.A v38.1,37.78 | LED113.A v38.1,55.56 | LED153.A v38.1,64.45 | LED173.A v36.83,70.17 | LED93.A v38.1,51.12 | LED73.A v38.1,46.67 | LED53.A v38.1,42.23 | LED133.A v38.1,60.01
  Bottom 0.61: v39.37,74.61 v36.83,70.17 v38.1,64.45 v38.1,60.01 v38.1,55.56 v38.1,51.12 v38.1,46.67 v38.1,42.23 v38.1,37.78 v38.1,33.34
D14  (via drill 0.8)
  Top 0.61: LED194.A v34.92,74.61 | LED15.A v33.66,33.34 33.66,31.85 arc-90 R15.2 | LED34.A v33.66,37.78 | LED174.A v34.92,70.17 | LED154.A v32.38,65.72 | LED134.A v33.66,60.01 | LED94.A v33.66,51.12 | LED74.A v33.66,46.67 | LED54.A v33.66,42.23 | LED114.A v33.66,55.56
  Bottom 0.61: v34.92,74.61 v34.92,70.17 v32.38,65.72 v33.66,60.01 v33.66,55.56 v33.66,51.12 v33.66,46.67 v33.66,42.23 v33.66,37.78 v33.66,33.34
D15  (via drill 0.8)
  Top 0.61: LED195.A v30.48,74.61 | LED16.A v29.21,33.34 29.21,31.85 arc-90 R16.2 | LED35.A v29.21,37.78 | LED135.A v27.94,61.28 | LED115.A v29.21,55.56 | LED75.A v29.21,46.67 | LED55.A v29.21,42.23 | LED155.A v30.48,65.72 | LED175.A v30.48,70.17 | LED95.A v29.21,51.12
  Bottom 0.61: v30.48,74.61 v30.48,70.17 v30.48,65.72 v27.94,61.28 v29.21,55.56 v29.21,51.12 v29.21,46.67 v29.21,42.23 v29.21,37.78 v29.21,33.34
D16  (via drill 0.8)
  Top 0.61: LED196.A v26.04,74.61 | LED17.A v24.77,33.34 24.77,31.85 R17.2 | LED36.A v24.77,37.78 | LED56.A v24.77,42.23 | LED96.A v24.77,51.12 | LED116.A v23.5,56.83 | LED136.A v26.04,61.28 | LED176.A v26.04,70.17 | LED156.A v26.04,65.72 | LED76.A v24.77,46.67
  Bottom 0.61: v26.04,74.61 v26.04,70.17 v26.04,65.72 v26.04,61.28 v23.5,56.83 v24.77,51.12 v24.77,46.67 v24.77,42.23 v24.77,37.78 v24.77,33.34
D17  (via drill 0.8)
  Top 0.61: LED197.A v21.59,74.61 | LED18.A v20.32,33.34 20.32,31.85 R18.2 | LED37.A v20.32,37.78 | LED157.A v21.59,65.72 | LED137.A v21.59,61.28 | LED117.A v21.59,56.83 | LED97.A v19.05,52.39 | LED77.A v20.32,46.67 | LED177.A v21.59,70.17 | LED57.A v20.32,42.23
  Bottom 0.61: v21.59,74.61 v21.59,70.17 v21.59,65.72 v21.59,61.28 v21.59,56.83 v19.05,52.39 v20.32,46.67 v20.32,42.23 v20.32,37.78 v20.32,33.34
D18  (via drill 0.8)
  Top 0.61: LED198.A v17.14,74.61 | LED19.A v15.88,33.34 16.41,32.8 R19.2 | LED178.A v17.14,70.17 | LED58.A v15.88,42.23 | LED78.A v14.61,47.94 | LED98.A v17.14,52.39 | LED118.A v17.14,56.83 | LED138.A v17.14,61.28 | LED158.A v17.14,65.72 | LED38.A v15.88,37.78
  Bottom 0.61: v17.14,74.61 v17.14,70.17 v17.14,65.72 v17.14,61.28 v17.14,56.83 v17.14,52.39 v14.61,47.94 v15.88,42.23 v15.88,37.78 v15.88,33.34
D19  (via drill 0.8)
  Top 0.61: LED199.A v12.7,74.61 | LED179.A v12.7,70.17 | R20.2 11.43,31.85 v11.43,33.34 LED1.A | LED159.A v12.7,65.72 | LED39.A v11.43,37.78 | LED139.A v12.7,61.28 | LED119.A v12.7,56.83 | LED99.A v12.7,52.39 | LED79.A v12.7,47.94 | LED59.A v10.16,43.5
  Bottom 0.61: v12.7,74.61 v12.7,70.17 v12.7,65.72 v12.7,61.28 v12.7,56.83 v12.7,52.39 v12.7,47.94 v10.16,43.5 v11.43,37.78 v11.43,33.34
DATA
  Top 0.406: IC1.14 87,14.29 83.82,11.11 68.9,11.11 67.31,9.53 64.45,9.53 61.28,12.7 61.28,13.65 60.74,14.19 U1.15
GND  (via drill 0.6, 0.8)
  Top 0.406: v73.66,20.09 U1.21 58.1,20.09 | C2.1 45.31,17.56 v46.35,16.51 | C3.1 v49.53,11.11 C7.2 | U1.5 57.07,19.29 57.87,20.09 58.1,20.09 | C6.2 v57.47,9.21 | C4.2 v80.64,9.84 | C5.2 61.59,7.62 v62.87,8.89 | X2.5 10.79,20.62 2K.2 10.79,20.64 5.4,20.64 4.76,20 4.76,16.83 2.86,14.92 v2.86,14.29 | C9.2 13.65,15.46 13.65,19.37 14.61,20.32 IC3.8 | U3.2 11.43,13.34 10.48,12.38 v9.21,12.38 | U1.3 57.3,20.89 58.1,20.09
  Top 0.61: IC1.8 80.59,23.18 v79.38,23.18 | IC2.8 26.04,22.23 v24.77,20.95 | SV1.6 64.14,4.13 63.18,5.08 52.39,5.08 51.44,4.13 SV1.1 | v49.53,11.11 49.53,13.34 v46.35,16.51 | C8.2 11.85,25.61 v13.34,24.13 14.61,22.86 IC3.8
  Top 1.016: Q19.2 v1.91,75.25 | Q16.2 v1.91,70.8 | Q14.2 v1.91,66.36 | Q12.2 v1.91,61.91 | Q10.2 v1.91,57.47 | Q8.2 v1.91,53.02 | Q6.2 v1.91,48.58 | Q3.2 v1.91,44.13 | Q2.2 v1.91,39.69 | Q1.2 v1.91,35.24 | v29.53,7.94 v29.53,3.81
  Bottom 0.406: v46.35,16.51 46.67,16.83 | v49.53,11.11 50.48,11.11 | v62.87,8.89 63.5,8.89 | v57.47,9.21 58.1,9.21 | v80.64,9.84 81.28,9.84 | 47.62,3.49 46.67,3.49 | v9.21,12.38 8.57,12.38 | v2.86,14.29 2.86,15.24
  Bottom 0.61: v79.38,23.18 78.11,23.18 | v73.66,20.09 73.58,20.95 74.61,20.95 | v24.77,20.95 23.81,20.32 | v13.34,24.13 13.34,24.77 | v49.53,11.11 48.9,10.16 47.94,10.16
  Bottom 1.016: v1.91,75.25 1.91,74.3 | v1.91,70.8 1.91,71.75 | v1.91,66.36 1.91,67.31 | v1.91,61.91 1.59,62.23 1.59,63.18 | v1.91,57.47 1.91,58.42 | v1.91,53.02 1.91,54.29 | v1.91,44.13 1.91,45.09 2.22,45.4 2.22,45.72 | v1.91,39.69 1.91,40.64 | v1.91,35.24 1.91,36.2 | v29.53,7.94 29.53,8.89 | v1.91,48.58 1.91,49.85
  pour Bottom (isolate 0.406): 0,0 93.34,0 93.34,80.01 0,80.01
LATCH  (via drill 0.8)
  Top 0.406: U1.32 55.77,23.81 52.39,23.81 v52.07,23.5 | v67.94,21.91 77.15,21.91 78.74,20.32 82.55,20.32 84.45,18.41 IC1.12
  Top 0.61: v52.07,23.5 51.75,23.18 48.9,23.18 47.94,24.13 46.04,24.13 45.4,23.5 38.1,23.5 35.24,20.64 31.75,20.64 29.84,18.73 IC2.12 29.84,14.61 27.3,12.06 20.95,12.06 18.41,14.92 IC3.12
  Bottom 0.406: v52.07,23.5 59.37,23.5 61.91,20.95 66.36,20.95 67.31,21.91 v67.94,21.91
N$1
  Top 0.61: LED2.C LED3.C LED4.C LED5.C LED6.C LED7.C LED8.C LED9.C LED10.C LED11.C LED12.C LED13.C LED14.C LED15.C LED16.C LED17.C LED18.C LED19.C LED1.C LED20.C 5.66,36.31 Q1.3
N$2
  Top 0.61: LED21.C LED22.C LED23.C LED24.C LED25.C LED26.C LED27.C LED28.C LED29.C LED30.C LED31.C LED32.C LED33.C LED34.C LED35.C LED36.C LED37.C LED38.C LED39.C LED40.C 5.66,40.76 Q2.3
N$3
  Top 0.406: LED190.C 49.33,76.31 49.21,76.2
  Top 0.61: LED181.C LED182.C LED183.C LED184.C LED185.C LED186.C LED187.C LED188.C LED189.C LED190.C LED191.C LED192.C LED193.C LED194.C LED195.C LED196.C LED197.C LED198.C LED199.C LED200.C 5.66,76.31 arc90 Q19.3
N$4
  Top 0.61: LED41.C LED42.C LED43.C LED44.C LED45.C LED46.C LED47.C LED48.C LED49.C LED50.C LED51.C LED52.C LED53.C LED54.C LED55.C LED56.C LED57.C LED58.C LED59.C | LED59.C 11.43,45.09 | LED59.C LED60.C 5.66,45.2 Q3.3
N$5
  Top 0.406: LED76.C 22.66,49.65
  Top 0.61: LED61.C LED62.C LED63.C LED64.C LED65.C LED66.C LED67.C LED68.C LED69.C LED70.C LED71.C LED72.C LED73.C LED74.C LED75.C LED76.C LED77.C LED78.C LED79.C LED80.C 5.66,49.65 Q6.3
N$6
  Top 0.406: LED83.C 81.92,54.09
  Top 0.61: LED81.C LED82.C LED83.C LED84.C LED85.C LED86.C LED87.C LED88.C LED89.C LED90.C LED91.C LED92.C LED93.C LED94.C LED95.C LED96.C LED97.C LED98.C LED99.C LED100.C 5.66,54.09 Q8.3
N$7
  Top 0.406: LED114.C 31.55,58.53 31.43,58.42
  Top 0.61: LED101.C LED102.C LED103.C LED104.C LED105.C LED106.C LED107.C LED108.C LED109.C LED110.C LED111.C LED112.C LED113.C LED114.C LED115.C LED116.C LED117.C LED118.C LED119.C LED120.C 5.66,58.53 Q10.3
N$8
  Top 0.61: LED121.C LED122.C LED123.C LED124.C LED125.C LED126.C LED127.C LED128.C LED129.C LED130.C LED131.C LED132.C LED133.C LED134.C LED135.C LED136.C LED137.C LED138.C LED139.C LED140.C 5.66,62.98 Q12.3
N$9
  Top 0.61: LED141.C LED142.C LED143.C LED144.C LED145.C | LED145.C 73.66,67.31 | LED145.C LED146.C LED147.C LED148.C LED149.C LED150.C LED151.C LED152.C LED153.C LED154.C LED155.C LED156.C LED157.C LED158.C LED159.C LED160.C 5.66,67.42 Q14.3
N$10
  Top 0.61: LED161.C LED162.C LED163.C LED164.C LED165.C LED166.C LED167.C LED168.C LED169.C LED170.C LED171.C LED172.C LED173.C LED174.C LED175.C LED176.C LED177.C LED178.C LED179.C LED180.C 5.66,71.87 arc90 Q16.3
N$11  (via drill 0.8)
  Top 0.406: v64.45,25.72 64.77,25.4 64.77,22.23 64.23,21.68 U1.23
  Bottom 0.406: v64.45,25.72 64.45,27.3 60.96,30.8 54.29,30.8 53.66,31.43 50.8,31.43 49.21,33.02 R30.2
N$12  (via drill 0.8)
  Top 0.406: U1.24 v63.03,23.75
  Bottom 0.406: v63.03,23.75 63.03,27.14 60.33,29.84 53.34,29.84 52.7,30.48 49.85,30.48 49.53,30.8 46.99,30.8 44.77,33.02 R31.2
N$13  (via drill 0.8)
  Top 0.406: v51.75,28.89 53.34,28.89 54.93,30.48 60.01,30.48 63.18,27.3 63.18,25.4 62.87,25.08 61.91,25.08 61.59,24.77 61.59,24.04 U1.25
  Bottom 0.406: R32.2 40.32,30.8 41.59,29.53 46.35,29.53 46.67,29.84 49.21,29.84 50.16,28.89 v51.75,28.89
N$14  (via drill 0.8)
  Top 0.406: U1.26 60.74,25.5 v61.59,26.35
  Bottom 0.406: R33.2 35.88,30.8 38.1,28.57 46.67,28.57 46.99,28.89 48.9,28.89 50.48,27.3 52.39,27.3 53.98,28.89 59.05,28.89 v61.59,26.35
N$15  (via drill 0.8)
  Top 0.406: v47.94,27.62 53.34,27.62 55.24,29.53 58.1,29.53 59.94,27.69 U1.27
  Bottom 0.406: R34.2 31.43,30.8 34.61,27.62 v47.94,27.62
N$16  (via drill 0.8)
  Top 0.406: v44.13,26.35 48.9,26.35 49.21,26.67 53.66,26.67 55.56,28.57 57.47,28.57 59.14,26.91 U1.28
  Bottom 0.406: R35.2 26.67,51.85 26.67,30.8 31.11,26.35 v44.13,26.35
N$17
  Top 0.61: IC1.2 88.27,27.62 85.09,30.8 85.09,31.65 R3.1
N$18
  Top 0.61: IC1.3 87,26.99 83.82,30.16 81.28,30.16 80.64,30.8 80.64,31.65 R4.1
N$19
  Top 0.61: IC1.4 85.72,26.35 83.19,28.89 80.64,28.89 79.38,30.16 76.83,30.16 76.2,30.8 76.2,31.65 R5.1
N$20
  Top 0.61: IC1.5 84.45,25.72 82.55,27.62 80.01,27.62 78.74,28.89 76.2,28.89 74.93,30.16 72.39,30.16 71.75,30.8 71.75,31.65 R6.1
N$21
  Top 0.61: IC1.6 83.19,25.08 81.92,26.35 79.38,26.35 78.11,27.62 75.56,27.62 74.3,28.89 71.75,28.89 70.48,30.16 67.94,30.16 67.31,30.8 67.31,31.65 R7.1
N$22
  Top 0.61: IC1.7 81.92,24.45 81.28,25.08 78.74,25.08 77.47,26.35 74.93,26.35 73.66,27.62 71.12,27.62 69.85,28.89 64.77,28.89 62.87,30.8 62.87,31.65 R8.1
N$23  (via drill 0.8)
  Top 0.61: R9.1 58.1,32.17 v58.1,33.34 | v38.1,20.64 36.83,19.37 34.29,19.37 33.66,18.73 IC2.15
  Bottom 0.61: v58.1,33.34 58.1,32.7 59.05,31.75 61.59,31.75 67.94,25.4 67.94,24.13 69.53,22.54 69.53,20.95 67.31,18.73 61.59,18.73 58.42,21.91 49.21,21.91 47.31,20 38.73,20 v38.1,20.64
N$24
  Top 0.61: IC2.1 34.92,24.45 35.56,25.08 38.1,25.08 39.37,26.35 41.91,26.35 43.18,27.62 45.72,27.62 46.99,28.89 49.53,28.89 50.8,30.16 52.7,30.16 53.44,30.9 54.08,31.54 R10.1
N$25
  Top 0.61: IC2.2 33.66,25.08 34.92,26.35 37.47,26.35 38.73,27.62 41.27,27.62 42.55,28.89 45.09,28.89 46.35,30.16 48.9,30.16 49.63,30.9 R11.1
N$26
  Top 0.61: IC2.3 32.38,25.72 34.29,27.62 36.83,27.62 38.1,28.89 40.64,28.89 41.91,30.16 44.45,30.16 45.19,30.9 R12.1
N$27
  Top 0.61: IC2.4 31.11,26.35 33.66,28.89 36.2,28.89 37.47,30.16 40.01,30.16 40.74,30.9 R13.1
N$28
  Top 0.61: IC2.5 29.84,26.99 33.02,30.16 35.56,30.16 36.3,30.9 R14.1
N$29
  Top 0.61: IC2.6 28.57,27.62 31.85,30.9 R15.1
N$30
  Top 0.61: IC2.7 27.3,31.65 R16.1
N$31
  Top 0.61: IC3.1 23.5,27.62 22.86,28.26 22.86,31.65 R17.1
N$32
  Top 0.61: IC3.2 22.23,26.99 18.41,30.8 18.41,31.65 R18.1
N$33
  Top 0.61: IC3.3 20.95,26.35 17.14,30.16 15.24,30.16 14.61,30.8 14.61,31.65 R19.1
N$34
  Top 0.61: IC3.4 19.68,25.72 16.51,28.89 14.61,28.89 13.34,30.16 10.16,30.16 9.53,30.8 9.53,31.65 R20.1
N$35
  Top 0.61: IC3.5 18.41,25.08 15.88,27.62 13.97,27.62 12.7,28.89 9.53,28.89 8.26,30.16 5.71,30.16 5.08,30.8 5.08,31.65 R1.1
N$36
  Top 0.61: IC1.1 89.53,31.65 R2.1
N$37
  Top 0.406: 47.95,17.59 Y1.3 48.22,17.46 50.16,17.46 51.12,18.41 52.39,18.41 53.12,17.68 U1.7 | 47.95,17.21 47.95,17.59 | 47.95,17.59 C2.2
N$38  (via drill 0.8)
  Top 0.406: U1.29 58.34,26.12 57.15,27.3 v56.52,27.3 | R21.1 arc90 66.36,27.2 66.4,27.16 C1.2
  Bottom 0.406: v56.52,27.3 57.15,27.3 62.55,21.91 65.41,21.91 66.36,22.86 66.36,24.73 C1.2
N$39
  Top 0.406: C3.2 53.02,15.91 Y1.1 52.65,16.89 U1.8
N$40
  Top 1.016: SV4.3 5.71,6.03 6.67,5.08 SV2.3
N$41
  Top 0.406: LED321.C 470R.1
N$42
  Top 0.406: 470R.2 9.45,14.26 U3.1
N$43
  pour Top (isolate 0.406): 0,80.01 93.34,80.01 93.34,0 0,0
N$44
  Top 0.406: R23.2 55.68,15.14 U1.9
N$45
  Top 0.406: U1.13 59.14,13.89 59.37,13.65 59.37,10.58 R24.2
N$46
  Top 0.406: 2K.1 10.48,18.39 U3.5
N$47  (via drill 0.8)
  Top 0.406: IC2.14 32.38,15.24 33.34,14.29 36.2,14.29 38.1,16.19 41.27,16.19 45.09,12.38 v47.31,12.38 | v66.04,11.11 66.04,13.65 66.67,14.29 69.53,14.29 70.8,13.02 77.15,13.02 80.64,16.51 IC1.9
  Bottom 0.406: v47.31,12.38 60.64,12.38 61.91,11.11 v66.04,11.11
N$48
  Top 0.61: IC2.9 26.04,15.24 25.72,14.92 23.81,14.92 23.5,15.24 21.91,15.24 20.95,16.19 IC3.14
N$49
  Top 0.406: U1.16 63.13,15.39 R26.2
N$52
  Top 0.406: U1.11 57.54,13.3 R40.2
N$54  (via drill 0.8)
  Top 0.406: U1.1 52.97,22.48 52.7,22.23 47.25,22.23 v46.99,22.48
  Bottom 0.406: R36.2 13.65,30.8 21.65,22.8 46.67,22.8 v46.99,22.48
N$55  (via drill 0.8)
  Top 0.406: U1.2 53.12,21.68 52.7,21.27 46.04,21.27 45.62,21.68 v44.77,21.68
  Bottom 0.406: R37.2 9.53,30.8 18.32,22 44.45,22 v44.77,21.68
RST
  Bottom 0.406: C1.1 71.4,21.55 71.44,20.32 69.85,18.73 69.85,8.26 67.31,5.71 57.78,5.71 56.52,4.45 SV1.3
RX  (via drill 0.8)  (1 unrouted)
  Top 0.406: v40.32,25.08 48.9,25.08 49.53,25.72 53.98,25.72 54.29,26.04 56.83,26.04 57.54,25.33 U1.30
  Bottom 0.406: R38.2 22.54,30.8 28.26,25.08 v40.32,25.08
TOUCH1  (via drill 0.8)
  Top 0.406: U1.19 64.52,18.48 65.09,19.05 72.39,19.05 v73.66,17.78 | v76.83,17.78 76.83,16.51 75.72,15.4 | 75.72,15.4 75.56,15.24 | 75.56,15.24 R26.1 | SV3.4 32.38,8.89 35.56,5.71 51.44,5.71 51.75,6.03 62.87,6.03 65.41,8.57 67.94,8.57 69.22,9.84 v75.56,9.84 C4.1 | v75.56,14.29 75.56,15.24 | 75.56,15.24 arc-90 75.72,15.4
  Bottom 0.406: v73.66,17.78 v76.83,17.78 | v75.56,9.84 v75.56,14.29
TOUCH2
  Top 0.406: U1.14 59.94,14.04 60.33,13.65 60.33,11.75 60.96,11.11 60.96,10.69 R24.1 60.86,9.42 59.05,7.62 | SV3.3 34.92,8.89 37.15,6.67 51.12,6.67 51.44,6.99 58.42,6.99 59.05,7.62 | 59.11,7.88 C5.1 59.05,7.62
TOUCH3
  Top 0.406: U1.10 56.74,14.51 55.56,13.34 55.03,13.34 R23.1 54.93,12.06 54.13,11.27 53.98,11.11 | SV3.1 41.91,8.89 51.75,8.89 53.98,11.11 | C7.1 53.98,11.11
TOUCH4
  Top 0.406: U1.12 58.34,14.05 58.42,13.65 58.42,11.75 58.1,11.43 57.57,11.43 R40.1 56.94,11.43 56.2,11.43 53.98,9.21 | SV3.2 37.47,9.53 39.37,7.62 50.8,7.62 51.12,7.94 52.7,7.94 53.98,9.21 | C6.1 53.98,9.21
TX  (via drill 0.8)  (1 unrouted)
  Top 0.406: v50.48,24.45 50.8,24.77 54.29,24.77 54.93,25.4 56.2,25.4 56.74,24.86 U1.31
  Bottom 0.406: R39.2 18.1,30.8 25.08,23.81 49.85,23.81 v50.48,24.45

### Text on the board
Top: Jacob Burge | LED MATRIX V1.0